# EAGLE design boarduino-shield-adapter (EAGLE 5.10)
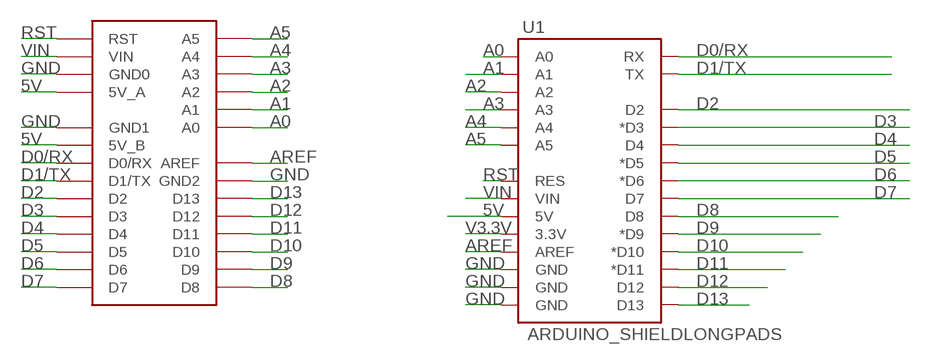
[diagram p0: schematic, sheet 1]

## Parts
U1  ARDUINO_SHIELDLONGPADS  [DUEMILANOVE_SHIELD_LONGPADS]
U$1  BOARDUINO  [BOARDUINO_LONGPADS]

## Nets
5V: U1.5V U$1.4(5V_A) U$1.6(5V_B)
A0: U1.A0 U$1.23(A0)
A1: U1.A1 U$1.24(A1)
A2: U1.A2 U$1.25(A2)
A3: U1.A3 U$1.26(A3)
A4: U1.A4 U$1.27(A4)
A5: U1.A5 U$1.28(A5)
AREF: U1.AREF U$1.22(AREF)
D0/RX: U1.RX U$1.7(D0/RX)
D1/TX: U1.TX U$1.8(D1/TX)
D2: U1.D2 U$1.9(D2)
D3: U1.D3(*D3) U$1.10(D3)
D4: U1.D4 U$1.11(D4)
D5: U1.D5(*D5) U$1.12(D5)
D6: U1.D6(*D6) U$1.13(D6)
D7: U1.D7 U$1.14(D7)
D8: U1.D8 U$1.15(D8)
D9: U1.D9(*D9) U$1.16(D9)
D10: U1.D10(*D10) U$1.17(D10)
D11: U1.D11(*D11) U$1.18(D11)
D12: U1.D12 U$1.19(D12)
D13: U1.D13 U$1.20(D13)
GND: U1.GND@0(GND) U1.GND@1(GND) U1.GND@2(GND) U$1.3(GND0) U$1.5(GND1) U$1.21(GND2)
RST: U1.RES U$1.1(RST)
V3.3V: U1.3.3V
VIN: U1.VIN U$1.2(VIN)

## Library data of the parts
U1 = SparkFun:ARDUINO_SHIELD
U$1 = ideabot:BOARDUINO

## Board
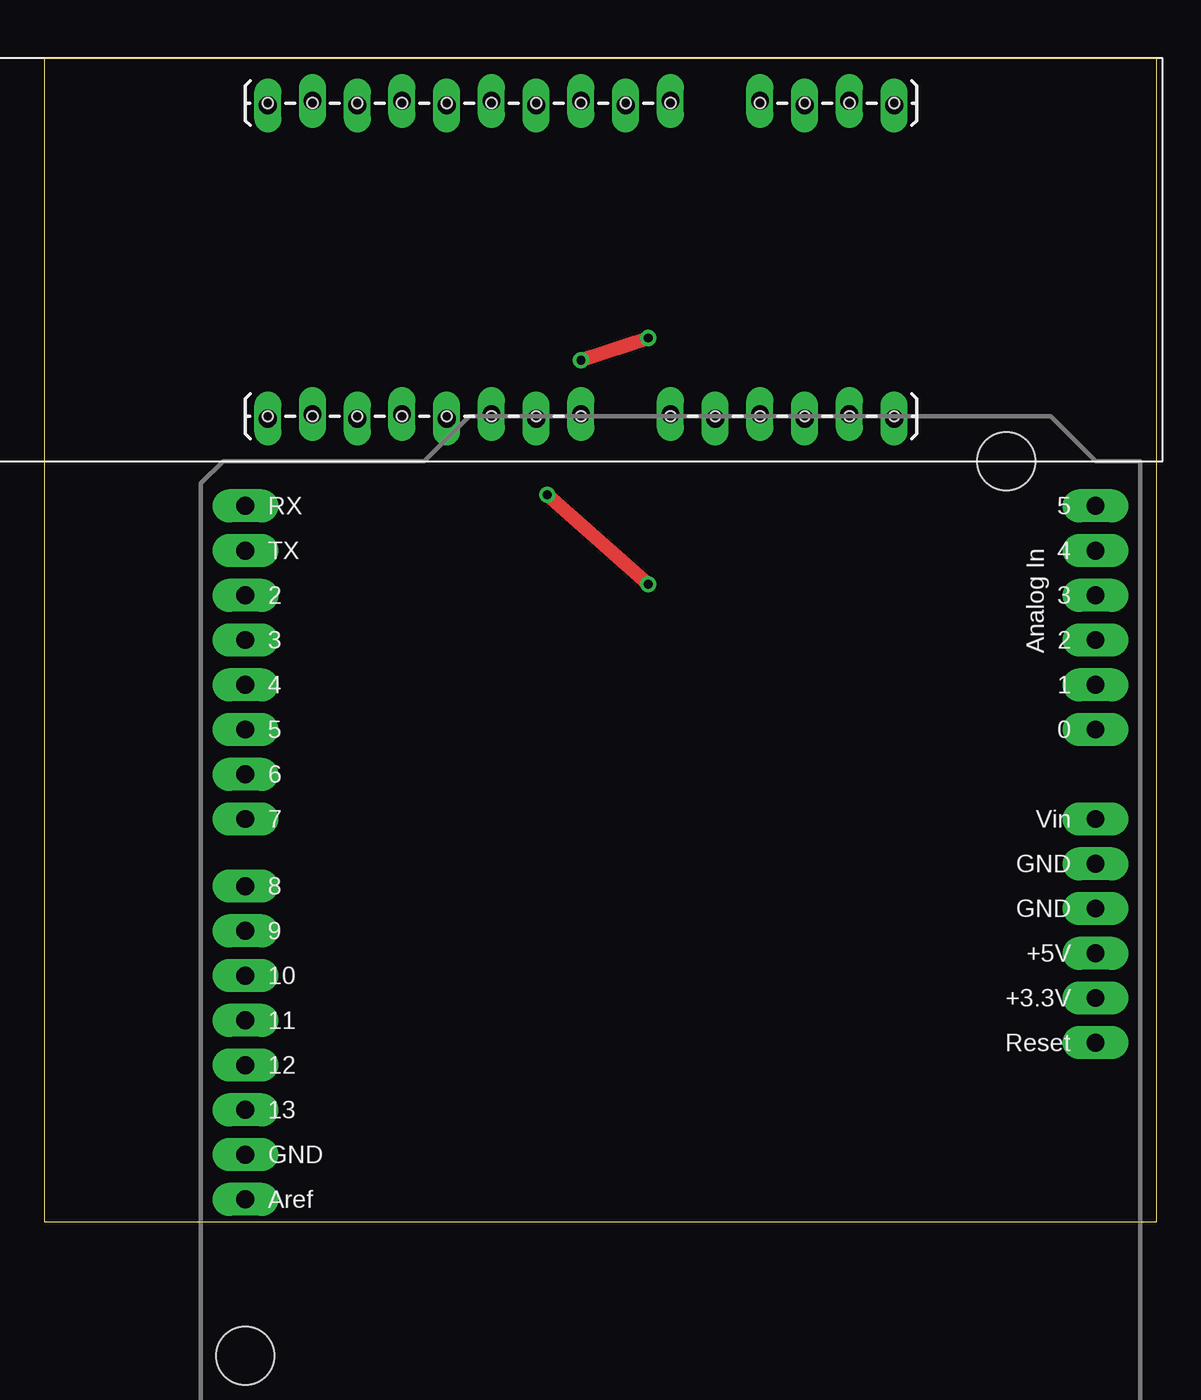
[diagram p1: board, top side]
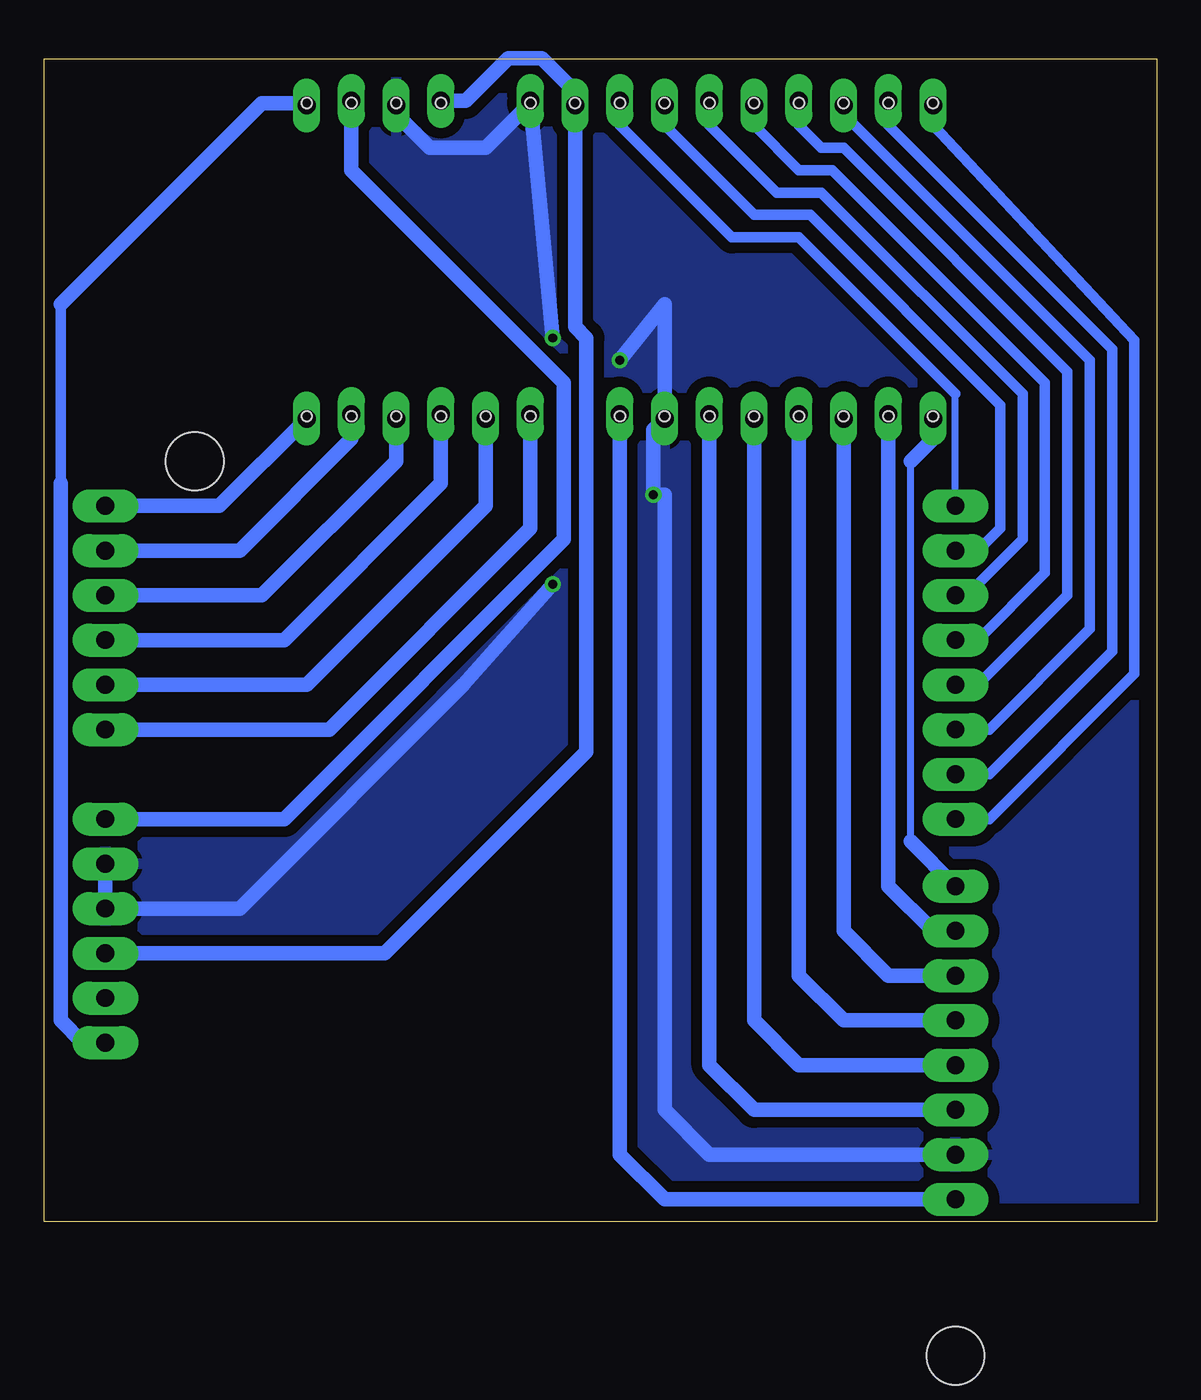
[diagram p2: board, bottom side, seen from below]

Size 63.17 x 66.03 mm. Coordinates in mm from the lower left corner, seen from the top.
Outline: 0,0 63.17,0 63.17,66.03 0,66.03 0,0
Copper layers (1*16): Top 0.035mm / dielectric 1.5mm / Bottom 0.035mm
Design rules "default": minimum track width 10mil, minimum drill 24mil, track to track 8mil, track to pad 8mil, pad to pad 8mil, via to via 8mil, smd to smd 8mil, copper to edge 40mil, drill to drill 8mil, minimum pad ring 10mil, minimum via ring 8mil, stop-mask expansion 4mil, vias tented up to drill 0mil, thermal gap 10mil

### Footprints (pad centres in the part's own frame; a part is rotated, then mirrored left to right if it is on the bottom)
DUEMILANOVE_SHIELD_LONGPADS = drill 1.016 pad 1.88 long: 3.3V 50.8,26.67; 5V 50.8,29.21; A0 50.8,41.91; A1 50.8,44.45; A2 50.8,46.99; A3 50.8,49.53; A4 50.8,52.07; A5 50.8,54.61; AREF 2.54,15.24; D2 2.54,49.53; D3 2.54,46.99; D4 2.54,44.45; D5 2.54,41.91; D6 2.54,39.37; D7 2.54,36.83; D8 2.54,33.02; D9 2.54,30.48; D10 2.54,27.94; D11 2.54,25.4; D12 2.54,22.86; D13 2.54,20.32; GND@0 50.8,31.75; GND@1 50.8,34.29; GND@2 2.54,17.78; RES 50.8,24.13; RX 2.54,54.61; TX 2.54,52.07; VIN 50.8,36.83 | hole 3.302: 45.72,57.15; 2.54,6.35
BOARDUINO_LONGPADS = drill 1.016 long: 1 17.78,7.493; 2 15.24,7.747; 3 12.7,7.493; 4 10.16,7.747; 5 5.08,7.747; 6 2.54,7.493; 7 0,7.747; 8 -2.54,7.493; 9 -5.08,7.747; 10 -7.62,7.493; 11 -10.16,7.747; 12 -12.7,7.493; 13 -15.24,7.747; 14 -17.78,7.493; 15 -17.78,-10.287; 16 -15.24,-10.033; 17 -12.7,-10.287; 18 -10.16,-10.033; 19 -7.62,-10.287; 20 -5.08,-10.033; 21 -2.54,-10.287; 22 0,-10.033; 23 5.08,-10.033; 24 7.62,-10.287; 25 10.16,-10.033; 26 12.7,-10.287; 27 15.24,-10.033; 28 17.78,-10.287 | hole 0.6: -17.78,7.62; -15.24,7.62; -12.7,7.62; -10.16,7.62; -7.62,7.62; -5.08,7.62; -2.54,7.62; 0,7.62; 2.54,7.62; 5.08,7.62; 10.16,7.62; 12.7,7.62; 15.24,7.62; 17.78,7.62; 17.78,-10.16; 15.24,-10.16; 12.7,-10.16; 10.16,-10.16; 7.62,-10.16; 5.08,-10.16; 0,-10.16; -2.54,-10.16; -5.08,-10.16; -7.62,-10.16; -10.16,-10.16; -12.7,-10.16; -15.24,-10.16; -17.78,-10.16

### Placement (x,y rotation side)
U1  8.89,-13.97 0 top
U$1  30.48,55.88 0 top

### Tracks (layer width: path | path; a pad name or v marks a point on that pad's centre or on a via)
5V
  Bottom 0.813: U1.5V 43.81,15.24 32.38,26.67 32.38,50.16 33.02,50.8 U$1.6 33.02,64.13 34.92,66.04 36.83,66.04 39.24,63.63 U$1.4
A0
  Bottom 0.813: U1.A0 46.99,27.94 35.56,39.37 U$1.23
A1
  Bottom 0.813: U1.A1 48.26,30.48 38.1,40.64 U$1.24
A2
  Bottom 0.813: U1.A2 49.53,33.02 40.64,41.91 U$1.25
A3
  Bottom 0.813: U1.A3 50.8,35.56 43.18,43.18 U$1.26
A4
  Bottom 0.813: U1.A4 52.07,38.1 45.72,44.45 U$1.27
A5
  Bottom 0.813: U1.A5 53.21,40.64 U$1.28
AREF
  Bottom 0.813: U1.AREF 27.94,1.27 30.48,3.81 U$1.22
D0/RX
  Bottom 0.406: U1.RX 11.43,46.99 | 30.48,62.23 U$1.7
  Bottom 0.61: 11.43,46.99 20.32,55.88 24.13,55.88 30.48,62.23
D1/TX
  Bottom 0.406: 27.94,62.23 U$1.8 27.94,64.13
  Bottom 0.61: U1.TX 10.16,38.1 8.89,39.37 8.89,46.36 19.68,57.15 22.86,57.15 27.94,62.23
D2
  Bottom 0.406: 25.4,62.23 U$1.9
  Bottom 0.61: U1.D2 10.79,35.56 7.62,38.73 7.62,46.99 19.05,58.42 21.59,58.42 25.4,62.23
D3
  Bottom 0.406: 22.86,62.23 U$1.10
  Bottom 0.61: 22.86,62.23 20.32,59.69 18.41,59.69 6.35,47.62 6.35,36.83 10.16,33.02 U1.D3
D4
  Bottom 0.406: 20.32,62.23 U$1.11 | 10.16,30.48 U1.D4
  Bottom 0.61: 20.32,62.23 19.05,60.96 17.78,60.96 5.08,48.26 5.08,35.56 10.16,30.48
D5
  Bottom 0.406: 17.14,62.23 U$1.12 | 9.53,27.94 U1.D5
  Bottom 0.61: 17.14,62.23 3.81,48.89 3.81,33.66 9.53,27.94
D6
  Bottom 0.406: 15.24,62.23 U$1.13 | 9.53,25.4 U1.D6
  Bottom 0.61: 15.24,62.23 2.54,49.53 2.54,32.39 9.53,25.4
D7
  Bottom 0.406: 9.53,22.86 U1.D7
  Bottom 0.61: 9.53,22.86 1.27,31.11 1.27,50.04 12.7,62.23 U$1.14
D8
  Bottom 0.406: 13.97,21.59 13.97,43.18
  Bottom 0.813: U1.D8 13.97,21.59 | 13.97,43.18 12.7,44.45 U$1.15
D9
  Bottom 0.813: U1.D9 12.7,16.51 15.24,19.05 U$1.16
D10
  Bottom 0.813: U1.D10 15.24,13.97 17.78,16.51 U$1.17
D11
  Bottom 0.813: U1.D11 17.78,11.43 20.32,13.97 U$1.18
D12
  Bottom 0.813: U1.D12 20.32,8.89 22.86,11.43 U$1.19
D13
  Bottom 0.813: U1.D13 22.86,6.35 25.4,8.89 U$1.20
GND  (via drill 0.51)
  Top 0.813: v28.57,41.27 v34.29,36.19 | v30.48,48.89 v34.29,50.16
  Bottom 0.813: U1.GND@1 U1.GND@0 52.07,17.78 39.37,30.48 v34.29,36.19 | U1.GND@2 25.4,3.81 27.94,6.35 27.94,41.27 v28.57,41.27 28.57,44.96 U$1.21 27.94,52.07 v30.48,48.89 | v34.29,50.16 U$1.5 35.56,63.5 38.1,60.96 41.27,60.96 43.18,62.86 U$1.3
  pour Bottom (isolate 0.61): -1.91,65.41 -1.91,0.63 62.23,0 62.23,66.04
RST
  Bottom 0.406: U1.RES 60.96,10.16
  Bottom 0.61: 62.23,41.91 62.23,52.07 | 48.39,63.5 U$1.1
  Bottom 0.813: 62.23,41.91 62.23,11.43 60.96,10.16 | 62.23,52.07 50.8,63.5 48.39,63.5
VIN
  Bottom 0.813: U1.VIN 49.53,22.86 33.65,38.73 33.65,47.62 45.72,59.69 U$1.2